# EAGLE design Shutter Pod Schematic (EAGLE 6.5.0)
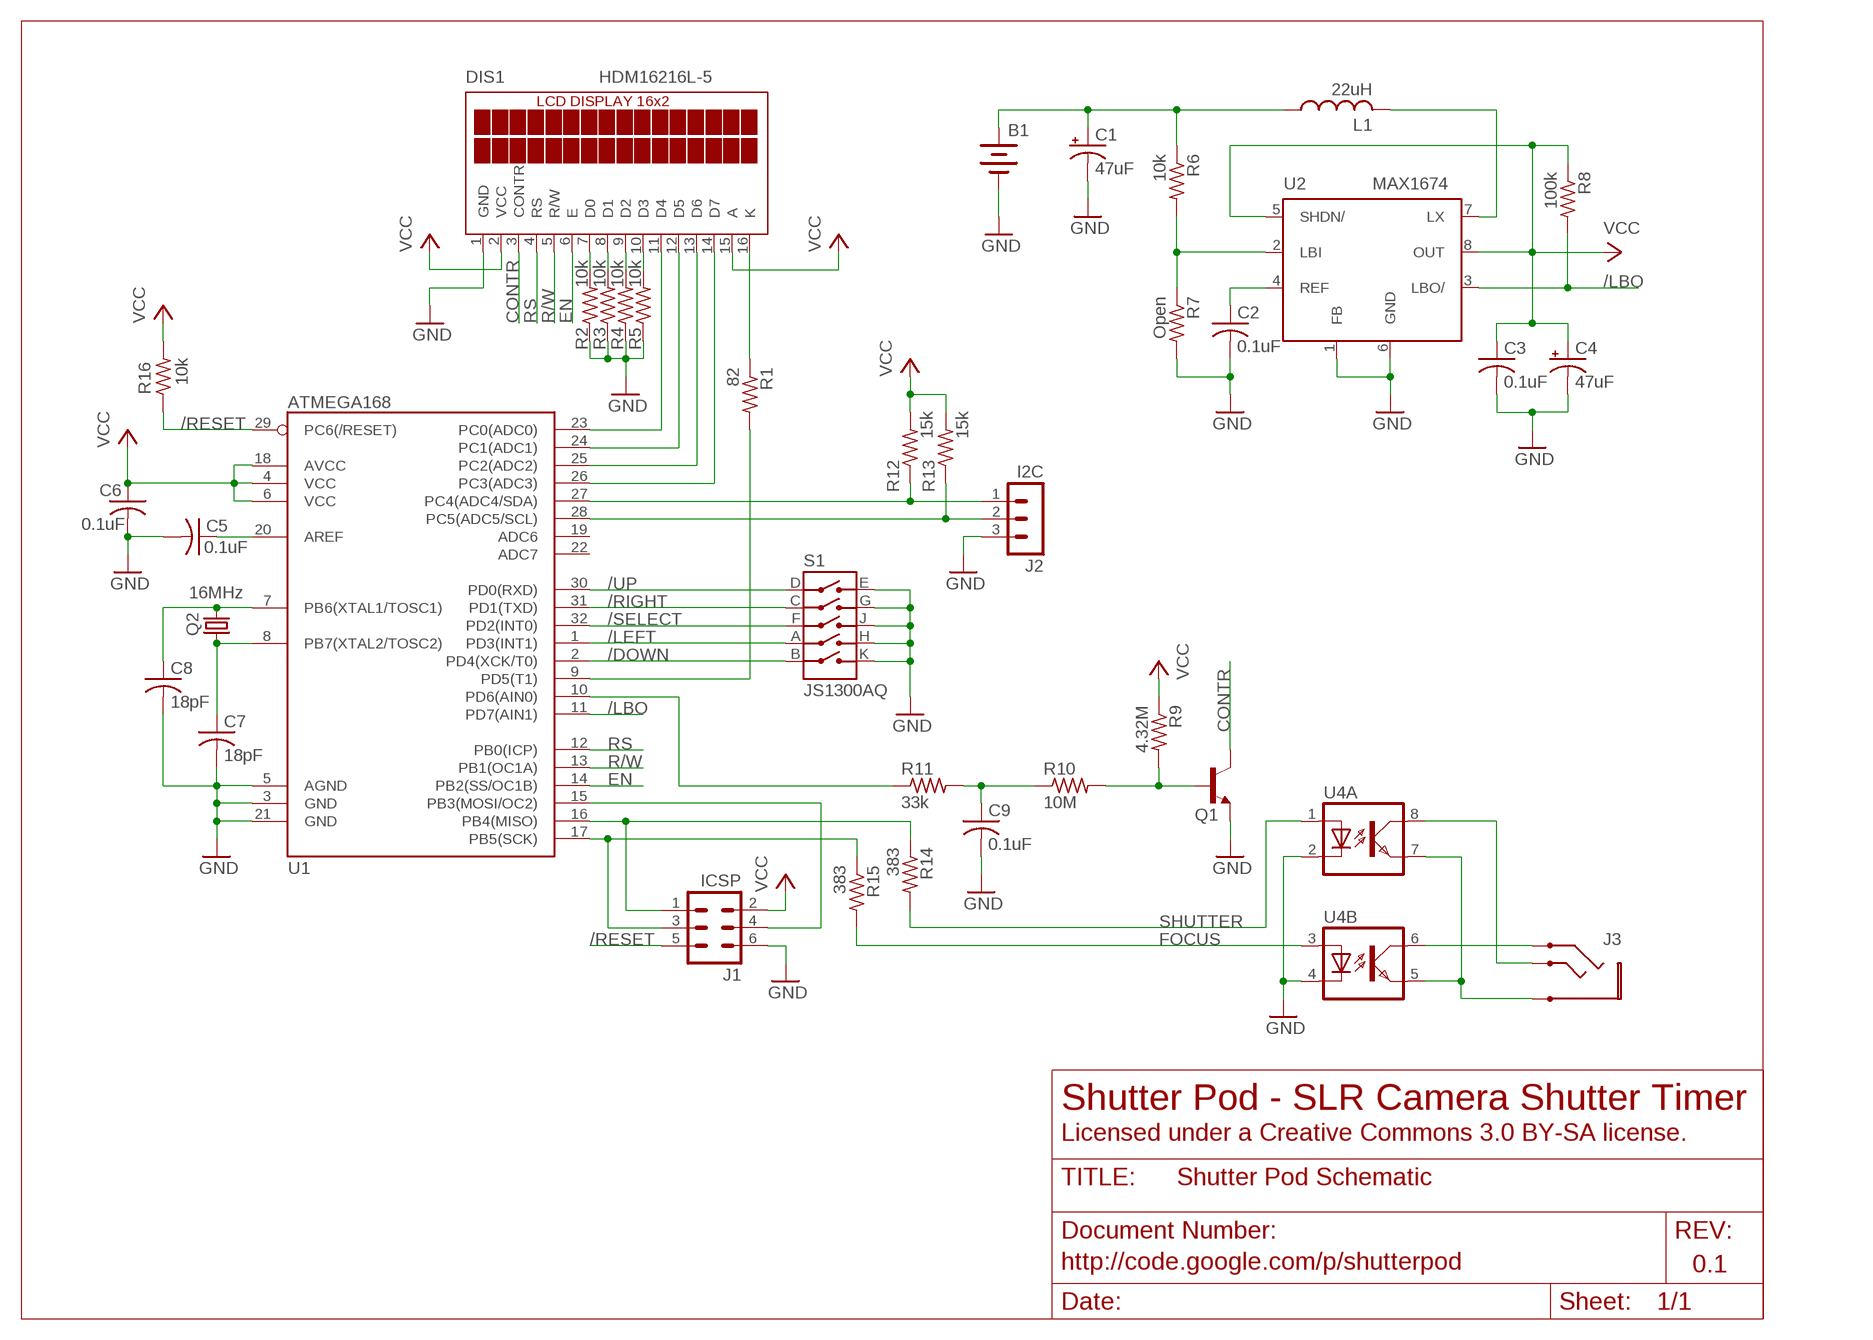
[diagram p0: schematic, sheet 1]

## Parts
B1  BATTERY  [BATTERY]
C1  47uF  CPOL-USSMCD  [SMC_D]
C2  0.1uF  C-USC0805  [C0805]
C3  0.1uF  C-USC0805  [C0805]
C4  47uF  CPOL-USSMCD  [SMC_D]
C5  0.1uF  C-USC0805  [C0805]
C6  0.1uF  C-USC0805  [C0805]
C7  18pF  C-USC0805  [C0805]
C8  18pF  C-USC0805  [C0805]
C9  0.1uF  C-USC0805  [C0805]
DIS1  HDM16216L-5  [HDM16216L-5]
J1  ICSP  MA03-2W  [MA03-2W]
J2  I2C  MA03-1W  [MA03-1W]
J3  2.5MM_AUDIO  [161-2625-E]
L1  22uH  L-USL2220P  [L2220P]
Q1  BC817-25SMD  [SOT23-BEC]
Q2  16MHz  CRYSTALHC49UP  [HC49UP]
R1  82  R-US_R0805  [R0805]
R2  10k  R-US_R0805  [R0805]
R3  10k  R-US_R0805  [R0805]
R4  10k  R-US_R0805  [R0805]
R5  10k  R-US_R0805  [R0805]
R6  10k  R-US_R0805  [R0805]
R7  Open  R-US_R0805  [R0805]
R8  100k  R-US_R0805  [R0805]
R9  4.32M  R-US_R0805  [R0805]
R10  10M  R-US_R0805  [R0805]
R11  33k  R-US_R0805  [R0805]
R12  15k  R-US_R0805  [R0805]
R13  15k  R-US_R0805  [R0805]
R14  383  R-US_R0805  [R0805]
R15  383  R-US_R0805  [R0805]
R16  10k  R-US_R0805  [R0805]
S1  JS1300AQ  [JS1300AQ]
U1  ATMEGA168  [TQFP32-08]
U2  MAX1674  [UMAX8]
U4  MOCD217M  [SO08]

## Nets
/DOWN: S1.B U1.2(PD4(XCK/T0))
/LBO: R8.2 U1.11(PD7(AIN1)) U2.3(LBO/)
/LEFT: S1.A U1.1(PD3(INT1))
/RESET: J1.5 R16.1 U1.29(PC6(/RESET))
/RIGHT: S1.C U1.31(PD1(TXD))
/SELECT: S1.F U1.32(PD2(INT0))
/UP: S1.D U1.30(PD0(RXD))
CONTR: DIS1.3(CONTR) Q1.C
EN: DIS1.6(E) U1.14(PB2(SS/OC1B))
FOCUS: R15.2 U4.3(B:A)
GND: B1.1(NEGATIVE) C1.- C2.2 C3.2 C4.- C5.2 C6.2 C7.2 C8.2 C9.2 DIS1.1(GND) J1.6 J2.3 Q1.E R2.1 R3.1 R4.1 R5.1 R7.2 S1.E S1.G S1.H S1.J S1.K U1.3(GND) U1.5(AGND) U1.21(GND) U2.1(FB) U2.6(GND) U4.2(A:C) U4.4(B:C)
MISO: J1.1 R14.1 U1.16(PB4(MISO))
MOSI: J1.4 U1.15(PB3(MOSI/OC2))
N$1: DIS1.11(D4) U1.23(PC0(ADC0))
N$2: DIS1.12(D5) U1.24(PC1(ADC1))
N$3: DIS1.13(D6) U1.25(PC2(ADC2))
N$4: DIS1.14(D7) U1.26(PC3(ADC3))
N$5: R1.2 U1.9(PD5(T1))
N$6: R11.1 U1.10(PD6(AIN0))
N$7: Q1.B R9.2 R10.2
N$8: DIS1.16(K) R1.1
N$10: B1.2(POSITIVE) C1.+ L1.1 R6.1
N$11: C5.1 U1.20(AREF)
N$12: DIS1.7(D0) R2.2
N$13: DIS1.8(D1) R3.2
N$14: DIS1.9(D2) R4.2
N$15: DIS1.10(D3) R5.2
N$16: C2.1 U2.4(REF)
N$18: R6.2 R7.1 U2.2(LBI)
N$19: C9.1 R10.1 R11.2
N$20: L1.2 U2.7(LX)
N$21: C8.1 Q2.2 U1.7(PB6(XTAL1/TOSC1))
N$22: C7.1 Q2.1 U1.8(PB7(XTAL2/TOSC2))
N$23: J3.SA(SLEEVE) U4.5(B:EMIT) U4.7(A:EMIT)
N$24: U4.6(B:COL)
N$28: J3.T(TIP) U4.8(A:COL)
R/W: DIS1.5(R/W) U1.13(PB1(OC1A))
RS: DIS1.4(RS) U1.12(PB0(ICP))
SCK: J1.3 R15.1 U1.17(PB5(SCK))
SCL: J2.2 R13.1 U1.28(PC5(ADC5/SCL))
SDA: J2.1 R12.1 U1.27(PC4(ADC4/SDA))
SHUTTER: R14.2 U4.1(A:A)
VCC: C3.1 C4.+ C6.1 DIS1.2(VCC) DIS1.15(A) J1.2 R8.1 R9.1 R12.2 R13.2 R16.2 U1.4(VCC) U1.6(VCC) U1.18(AVCC) U2.5(SHDN/) U2.8(OUT)
Unconnected: J3.R(RING) U1.19(ADC6) U1.22(ADC7)

## Notes on the sheet
- Shutter Pod - SLR Camera Shutter Timer
- Licensed under a Creative Commons 3.0 BY-SA license.
- http://code.google.com/p/shutterpod | 0.1

## Library data of the parts
B1 = shutter-pod:BATTERY
C1 C4 = rcl:CPOL-US: POLARIZED CAPACITOR, American symbol
C2 C3 C5-C9 = rcl:C-US: CAPACITOR, American symbol
DIS1 = shutter-pod:HDM16216L-5: Tuxgraphics LCD display 16x2 characters reflective, without background light Source: tuxgr_12x2_r2.pdf
J1 = con-lstb:MA03-2W
J2 = con-lstb:MA03-1W
J3 = shutter-pod:2.5MM_AUDIO
L1 = rcl:L-US: INDUCTOR, American symbol
Q1 = transistor-npn:BC817*: NPN Transistor
Q2 = crystal:CRYSTAL: CRYSTAL
R1-R16 = rcl:R-US_: RESISTOR, American symbol
S1 = switch-misc:JS1300AQ
U1 = SparkFun:ATMEGA168
U2 = maxim:MAX1674: DC/DC CONVERTER
U4 = shutter-pod:MOCD217M

## Board
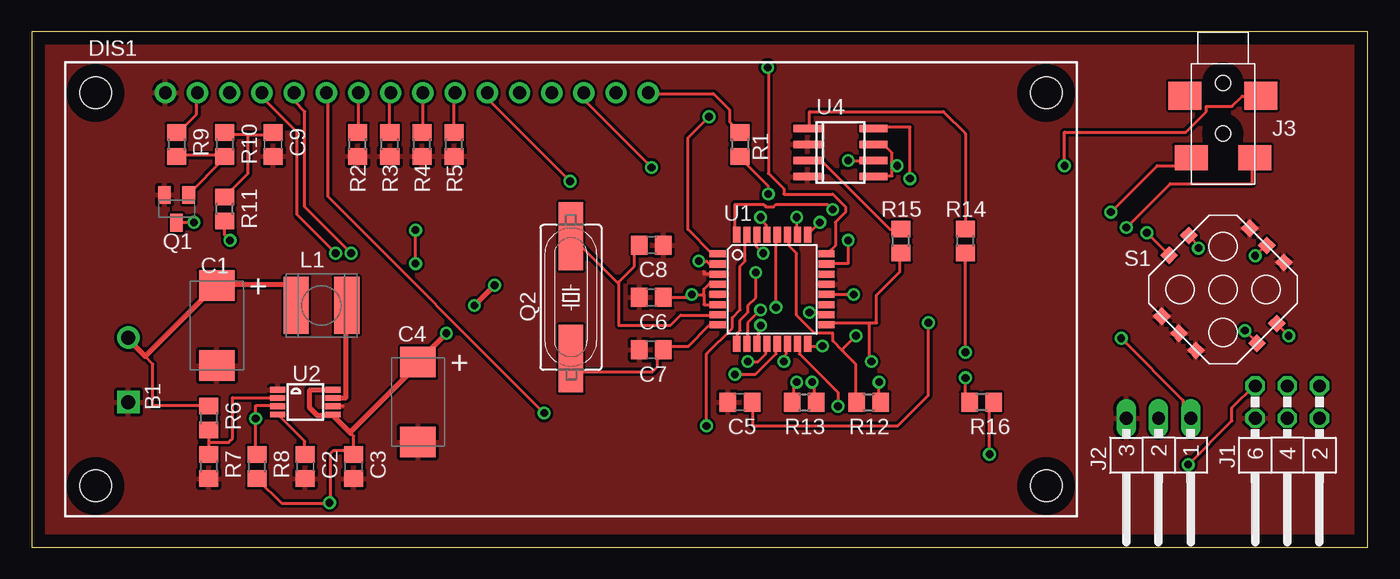
[diagram p1: board, top side]
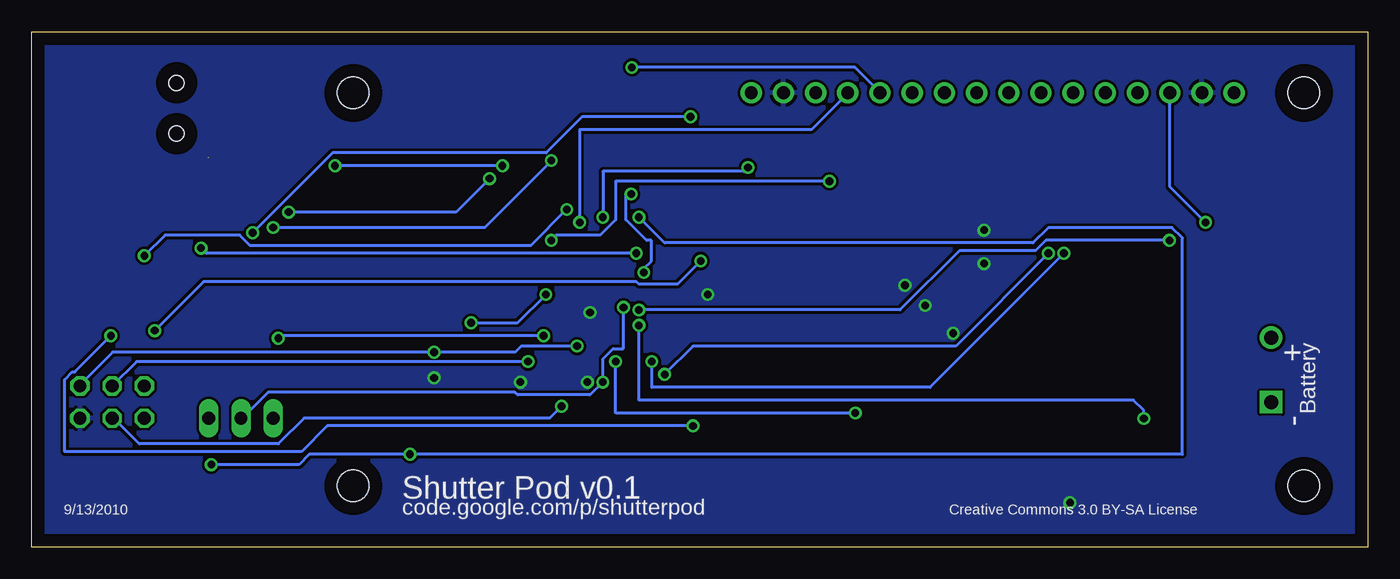
[diagram p2: board, bottom side, seen from below]

Size 105.41 x 40.64 mm. Coordinates in mm from the lower left corner, seen from the top.
Outline: 0,0 105.41,0 105.41,40.64 0,40.64 0,0
Copper layers (1*16): Top 0.035mm / dielectric 1.5mm / Bottom 0.035mm
Design rules "default": minimum track width 10mil, minimum drill 24mil, track to track 8mil, track to pad 8mil, pad to pad 8mil, via to via 8mil, smd to smd 8mil, copper to edge 40mil, drill to drill 8mil, minimum pad ring 10mil, minimum via ring 8mil, stop-mask expansion 4mil, vias tented up to drill 0mil, thermal gap 10mil

### Footprints (pad centres in the part's own frame; a part is rotated, then mirrored left to right if it is on the bottom)
BATTERY = drill 1.1 pad 1.778 square: 1 -2.54,0 | drill 1.1 pad 1.778: 2 2.54,0
SMC_D = smd 2.4 x 2.8: + -3.15,0; - 3.15,0
C0805 = smd 1.3 x 1.5: 1 -0.95,0; 2 0.95,0
HDM16216L-5 = drill 1 pad 1.676: 1 -32,15.5; 2 -29.46,15.5; 3 -26.92,15.5; 4 -24.38,15.5; 5 -21.84,15.5; 6 -19.3,15.5; 7 -16.76,15.5; 8 -14.22,15.5; 9 -11.68,15.5; 10 -9.14,15.5; 11 -6.6,15.5; 12 -4.06,15.5; 13 -1.52,15.5; 14 1.02,15.5; 15 3.56,15.5; 16 6.1,15.5 | hole 2.5: -37.5,-15.5; 37.5,-15.5; -37.5,15.5; 37.5,15.5
MA03-2W = drill 1.016 octagon: 1 -2.54,-5.08; 2 -2.54,-2.54; 3 0,-5.08; 4 0,-2.54; 5 2.54,-5.08; 6 2.54,-2.54
MA03-1W = drill 1.016 long: 1 -2.54,-2.54; 2 0,-2.54; 3 2.54,-2.54
161-2625-E = smd 2 x 2.6: R 7.4,2.5; T 7.4,-2.5 | smd 2.2 x 2.6: SA 2.5,3; SB 2.5,-3 | hole 1.2: 1.5,0; 5.5,0
L2220P = smd 2 x 4.5: 1 -2,0; 2 2,0
SOT23-BEC = smd 1 x 1.4: B -0.95,-1.1; C 0,1.1; E 0.95,-1.1
HC49UP = smd 5.334 x 1.93: 1 -4.826,0; 2 4.826,0
R0805 = smd 1.3 x 1.5: 1 -0.95,0; 2 0.95,0
JS1300AQ = smd 0.991 x 0.991: A -4.902,-1.105; B 4.902,-1.105; C 4.902,1.105; D -4.902,1.105; E -1.905,4.902; F 0,4.902; G 1.905,4.902; H -1.905,-4.902; J 0,-4.902; K 1.905,-4.902
TQFP32-08 = smd 1.27 x 0.559: 1 -4.293,2.8; 2 -4.293,2; 3 -4.293,1.2; 4 -4.293,0.4; 5 -4.293,-0.4; 6 -4.293,-1.2; 7 -4.293,-2; 8 -4.293,-2.8; 17 4.293,-2.8; 18 4.293,-2; 19 4.293,-1.2; 20 4.293,-0.4; 21 4.293,0.4; 22 4.293,1.2; 23 4.293,2; 24 4.293,2.8 | smd 0.559 x 1.27: 9 -2.8,-4.293; 10 -2,-4.293; 11 -1.2,-4.293; 12 -0.4,-4.293; 13 0.4,-4.293; 14 1.2,-4.293; 15 2,-4.293; 16 2.8,-4.293; 25 2.8,4.293; 26 2,4.293; 27 1.2,4.293; 28 0.4,4.293; 29 -0.4,4.293; 30 -1.2,4.293; 31 -2,4.293; 32 -2.8,4.293
UMAX8 = smd 0.45 x 1.2: 1 -0.975,-2.175; 2 -0.325,-2.175; 3 0.325,-2.175; 4 0.975,-2.175; 5 0.975,2.175; 6 0.325,2.175; 7 -0.325,2.175; 8 -0.975,2.175
SO08 = smd 0.6 x 2.2: 1 -1.905,-2.6; 2 -0.635,-2.6; 3 0.635,-2.6; 4 1.905,-2.6; 5 1.905,2.6; 6 0.635,2.6; 7 -0.635,2.6; 8 -1.905,2.6

### Placement (x,y rotation side)
B1  7.62,13.97 90 top
C1  14.61,17.46 270 top
C2  21.59,6.35 270 top
C3  25.4,6.35 270 top
C4  30.48,11.43 270 top
C5  55.88,11.43 180 top
C6  48.9,19.68 180 top
C7  48.9,15.56 180 top
C8  48.9,23.81 0 top
C9  19.05,31.75 270 top
DIS1  42.55,20.32 0 top
J1  99.06,7.62 180 top
J2  88.9,7.62 180 top
J3  93.98,38.1 270 top
L1  22.86,19.05 0 top
Q1  11.43,26.67 180 top
Q2  42.55,19.68 90 top
R1  55.88,31.75 270 top
R2  25.72,31.75 90 top
R3  28.26,31.75 90 top
R4  30.8,31.75 90 top
R5  33.34,31.75 90 top
R6  13.97,10.16 270 top
R7  13.97,6.35 270 top
R8  17.78,6.35 90 top
R9  11.43,31.75 270 top
R10  15.24,31.75 270 top
R11  15.24,26.67 90 top
R12  66.04,11.43 0 top
R13  60.96,11.43 0 top
R14  73.66,24.13 90 top
R15  68.58,24.13 90 top
R16  74.93,11.43 180 top
S1  93.98,20.32 315 top
U1  58.42,20.32 0 top
U2  21.59,11.43 270 top
U4  63.82,31.11 270 top

### Tracks (layer width: path | path; a pad name or v marks a point on that pad's centre or on a via)
/DOWN  (via drill 0.61)
  Top 0.254: v95.71,17.07 96.52,16.26 S1.B | v52.63,22.55 53.24,22.55 53.44,22.35 54.05,22.35 U1.2
  Bottom 0.254: v95.71,17.07 91.85,20.93 57.71,20.93 57.51,20.73 54.46,20.73 v52.63,22.55
/LBO  (via drill 0.61)
  Top 0.254: U2.3 19.3,11.18 17.68,11.18 v17.68,10.13 17.68,7.32 R8.2 | v57.51,17.48 57.51,17.07 57.3,16.87 57.3,16.05 U1.11
  Bottom 0.254: v57.51,17.48 57.51,11.58 18.49,11.58 17.68,10.77 v17.68,10.13
/LEFT  (via drill 0.61)
  Top 0.254: v87.99,24.79 89.61,23.16 S1.A | v53.44,33.93 51.77,32.26 51.77,25.04 53.65,23.16 54.05,23.16 U1.1
  Bottom 0.254: v87.99,24.79 81.69,31.09 64.82,31.09 61.98,33.93 v53.44,33.93
/RESET  (via drill 0.61)
  Top 0.254: v57.51,26.01 57.51,25.81 57.91,25.4 57.91,24.79 U1.29 | v91.24,6.5 94.69,9.96 94.69,10.97 96.52,12.8 J1.5 | v75.56,7.32 75.56,11.38 R16.1
  Bottom 0.254: v57.51,26.01 55.47,23.98 26.42,23.98 25.2,25.2 15.44,25.2 14.63,24.38 14.63,7.32 v75.56,7.32 83.52,7.32 84.33,6.5 v91.24,6.5
/RIGHT  (via drill 0.61)
  Top 0.254: v99.16,16.66 98.35,17.48 S1.C | v53.24,9.55 53.24,15.24 55.27,17.27 55.27,18.09 55.88,18.69 55.88,22.15 56.29,22.55 56.29,24.59 U1.31
  Bottom 0.254: v99.16,16.66 102.01,13.82 102.21,13.82 102.82,13.21 102.82,7.52 84.12,7.52 82.09,9.55 v53.24,9.55
/SELECT  (via drill 0.61)
  Top 0.254: v96.52,22.96 97.33,23.77 S1.F | v63.2,26.62 62.79,27.03 58.73,27.03 58.52,26.82 57.91,26.82 57.71,27.03 55.47,27.03 55.47,24.79 U1.32
  Bottom 0.254: v96.52,22.96 94.89,24.59 89,24.59 88.19,23.77 66.04,23.77 v63.2,26.62
/UP  (via drill 0.61)
  Top 0.254: v92.05,23.57 92.05,23.77 91.44,24.38 S1.D | v57.71,23.16 57.1,23.77 57.1,24.59 U1.30
  Bottom 0.254: v92.05,23.57 91.64,23.16 v57.71,23.16
CONTR  (via drill 0.61)
  Top 0.254: v12.8,25.6 11.58,25.6 Q1.C
  Bottom 0.254: v12.8,25.6 15.62,28.43 DIS1.3
EN  (via drill 0.61)
  Top 0.254: v59.33,14.63 59.33,15.04 59.54,15.24 59.54,15.85 U1.14 | v40.44,10.57 23.37,27.64 23.37,35.76 DIS1.6
  Bottom 0.254: v59.33,14.63 59.33,10.57 v40.44,10.57
FOCUS
  Top 0.254: 68.68,25.2 R15.2 67.71,25.08 62.31,30.48 U4.3
GND
  Top 0.254: U1.3 54.05,21.54 53.03,21.54 53.03,21.73 | 24.59,11.1 24.38,11.18 23.77,11.18 U2.6
  pour Top: 0,40.64 0,0 105.41,0 105.41,40.64
MISO  (via drill 0.61)
  Top 0.254: v62.38,15.85 61.37,15.85 U1.16 | v73.66,15.37 R14.1
  Bottom 0.254: J1.1 101.6,12.8 99.03,15.37 v73.66,15.37 67.26,15.37 66.79,15.85 v62.38,15.85
MOSI  (via drill 0.61)
  Top 0.254: v63.6,11.1 63.6,12.19 60.55,15.24 60.55,15.85 U1.15
  Bottom 0.254: v63.6,11.1 64.54,10.16 83.92,10.16 85.95,8.13 96.93,8.13 98.96,10.16 J1.4
N$1  (via drill 0.61)
  Top 0.254: v64.41,24.18 64.41,22.35 62.79,22.35 U1.23 | v42.47,28.85 35.97,35.36 35.97,35.76 DIS1.11
  Bottom 0.254: v64.41,24.18 64.01,24.59 60.55,24.59 59.33,25.81 59.33,28.85 v42.47,28.85
N$2  (via drill 0.61)
  Top 0.254: U1.24 62.79,23.16 63.4,23.77 63.4,25.6 64.21,26.42 64.21,26.82 63.2,27.84 59.33,27.84 59.33,28.25 58.12,29.46 58.12,37.8 v58.06,37.82
  Bottom 0.254: v58.06,37.82 40.46,37.82 38.61,35.97 DIS1.12
N$3  (via drill 0.61)
  Top 0.254: v62.18,25.6 61.37,24.79 U1.25
  Bottom 0.254: v62.18,25.6 62.18,32.92 43.89,32.92 41.05,35.76 DIS1.13
N$4  (via drill 0.61)
  Top 0.254: v60.35,26.01 60.35,24.79 U1.26 | v48.91,29.93 43.69,35.15 43.69,35.76 DIS1.14
  Bottom 0.254: v60.35,26.01 60.35,29.62 49.23,29.62 v48.91,29.93
N$5  (via drill 0.61)
  Top 0.254: v57.12,21.65 57.12,19.66 56.52,19.05 56.52,18.52 55.88,17.88 55.88,17.07 55.68,16.87 55.68,16.05 U1.9 | v58.12,27.84 58.12,28.45 55.88,30.68 R1.2
  Bottom 0.254: 58.52,27.64 58.52,25.81 56.9,24.18 56.52,24.18 56.52,22.54 57.12,21.93 v57.12,21.65 | 58.52,27.64 58.52,27.84 | v58.12,27.84 58.32,27.64 58.52,27.64
N$6  (via drill 0.61)
  Top 0.254: v57.51,18.69 56.49,17.68 56.49,16.05 U1.10 | v15.65,24.18 15.24,24.59 R11.1
  Bottom 0.254: v57.51,18.69 36.89,18.69 32.22,23.37 26.21,23.37 25.4,24.18 v15.65,24.18
N$7
  Top 0.254: Q1.B 12.39,27.84 15.24,30.68 R10.2 15.24,30.89 11.58,30.89 R9.2
N$8
  Top 0.254: R1.1 55.88,32.72 55.07,33.53 55.07,34.47 53.77,35.76 48.77,35.76 DIS1.16
N$10
  Top 0.254: 20.73,20.73 20.73,19.1 L1.1 | 14.63,20.73 C1.+ 14.43,20.52 | 8.94,15.04 9.55,14.43 9.55,11.18 13.82,11.18 R6.1
  Top 0.406: 14.63,20.73 20.73,20.73 | B1.2 7.72,16.46 7.72,16.26 8.94,15.04 14.43,20.52
N$11  (via drill 0.61)
  Top 0.254: v64.85,19.91 62.79,19.91 U1.20 | v70.74,17.68 70.74,11.96 68.33,9.55 56.9,9.55 56.9,11.38 C5.1
  Bottom 0.254: v64.85,19.91 67.08,17.68 v70.74,17.68
N$12
  Top 0.254: R2.2 25.81,32.72 25.81,35.76 DIS1.7
N$13
  Top 0.254: R3.2 28.25,32.72 28.25,35.76 DIS1.8
N$14
  Top 0.254: R4.2 30.89,32.72 30.89,35.76 DIS1.9
N$15
  Top 0.254: R5.2 33.33,32.72 33.33,35.76 DIS1.10
N$16
  Top 0.254: U2.4 19.51,10.36 21.54,8.33 21.54,7.32 C2.1
N$18
  Top 0.254: 14.02,8.26 15.56,8.26 15.85,8.55 15.85,11.79 19.3,11.79 U2.2 | R7.1 14.02,7.32 14.02,8.26 | 14.02,8.26 14.02,9.14 R6.2
N$19
  Top 0.254: 17.07,32.51 17.07,29.46 15.24,27.64 R11.2 | 17.07,32.51 15.24,32.51 R10.1 | 17.07,32.51 18.9,32.51 C9.1
N$20
  Top 0.254: U2.7 23.77,11.79 | 24.79,18.9 L1.2
  Top 0.406: 23.77,11.79 24.79,11.79 24.79,18.9
N$21
  Top 0.254: 42.67,25.6 42.67,24.59 Q2.2 46.33,20.73 | 46.33,20.73 46.33,20.93 47.55,22.15 47.55,23.57 47.75,23.77 C8.1 | 46.33,20.73 46.33,17.48 50.39,17.48 51.21,18.29 54.05,18.29 U1.7
N$22
  Top 0.254: U1.8 54.05,17.48 53.44,17.48 51.82,15.85 49.99,15.85 49.99,15.65 C7.1 49.78,15.44 49.38,15.04 49.38,14.22 48.97,13.82 42.67,13.82 42.67,14.83 Q2.1
N$23  (via drill 0.61)
  Top 0.254: 67.87,30.48 67.87,31.09 67.26,31.7 66.45,31.7 U4.7 | 67.87,30.48 67.87,29.26 66.45,29.26 U4.5 | v81.48,30.07 81.48,32.72 91.03,32.72 92.66,34.34 92.66,34.75 94.69,34.75 95.5,35.56 96.93,35.56 J3.SA | 67.87,30.48 v68.28,30.07
  Bottom 0.254: v68.28,30.07 v81.48,30.07
N$24  (via drill 0.61)
  Top 0.254: v86.36,25.2 89.81,28.65 96.32,28.65 96.32,30.68 | v64.41,30.48 U4.6
  Bottom 0.254: v64.41,30.48 69.7,25.2 v86.36,25.2
N$28  (via drill 0.61)  (1 unrouted)
  Top 0.254: v69.29,29.06 69.29,33.12 66.45,33.12 U4.8 | v85.14,26.42 88.8,30.07 91.44,30.07 91.44,30.68
  Bottom 0.254: v69.29,29.06 71.93,26.42 v85.14,26.42
R/W  (via drill 0.61)
  Top 0.254: v55.47,13.61 57.1,13.61 58.73,15.24 58.73,15.85 U1.13 | v25.2,23.16 21.54,26.82 21.54,34.34 20.73,35.15 20.73,35.76 DIS1.5
  Bottom 0.254: v55.47,13.61 53.24,15.85 32.51,15.85 v25.2,23.16
RS  (via drill 0.61)
  Top 0.254: v56.49,14.63 57.3,14.63 57.91,15.24 57.91,15.85 U1.12 | v23.98,23.16 20.93,26.21 20.93,32.72 18.29,35.36 18.29,35.76 DIS1.4
  Bottom 0.254: v56.49,14.63 56.49,12.6 34.54,12.6 v23.98,23.16
SCK  (via drill 0.61)
  Top 0.254: 66.04,17.68 66.65,17.68 66.65,19.86 68.48,21.69 68.48,23.16 R15.1 | 66.04,17.68 62.79,17.68 U1.17 | v66.24,14.63 66.04,14.83 66.04,17.68
  Bottom 0.254: v66.24,14.63 97.13,14.63 J1.3
SCL  (via drill 0.61)
  Top 0.254: v58.73,18.9 58.73,24.59 U1.28 | v60.35,13.01 60.15,12.8 60.15,11.58 R13.1
  Bottom 0.254: v58.73,18.9 58.73,15.65 59.54,15.65 60.35,14.83 v60.35,13.01 61.37,11.99 67.06,11.99 67.26,12.19 86.77,12.19 88.8,10.16 J2.2
SDA  (via drill 0.61)
  Top 0.254: 64.01,15.44 65.02,14.43 65.02,11.58 R12.1 | 64.01,15.44 63.2,16.26 63.2,16.87 61.77,16.87 60.35,18.29 60.35,23.16 59.74,23.77 59.74,24.59 U1.27 | J2.1 90.83,10.77 90.83,11.58 v85.95,16.46 | v65.02,16.66 64.01,15.65 64.01,15.44
  Bottom 0.254: v85.95,16.46 85.75,16.66 v65.02,16.66
SHUTTER
  Top 0.254: U4.1 61.37,33.12 61.37,34.34 71.93,34.34 73.66,32.61 R14.2
VCC  (via drill 0.61)
  Top 0.254: 23.57,12.39 U2.8 | 30.48,14.63 C4.+ 30.48,14.43 | 23.57,10.36 U2.5 23.77,10.36 | 25.2,9.14 25.2,8.94 25.4,8.74 25.4,7.62 | 25.4,7.62 C3.1 | 25.4,7.62 23.81,7.62 23.57,7.38 23.57,3.45 19.71,3.45 17.88,5.28 R8.1 | DIS1.2 13.01,35.76 13.01,34.14 11.58,32.72 R9.1 | v30.28,22.35 v30.28,24.99 | U1.4 54.05,20.73 53.43,20.73 53.03,20.33 53.03,19.91 | U1.6 53.03,19.12 53.03,19.91 | 53.03,19.91 v52.07,19.91 52.02,19.91 52.02,19.71 49.99,19.71 C6.1 | v61.57,13.01 61.77,12.8 61.77,11.58 R13.2 | v66.85,13.01 66.85,11.58 R12.2 | v61.37,18.49 62.59,18.49 U1.18 | v73.66,13.34 73.66,11.58 R16.2
  Top 0.406: 23.57,12.39 21.95,12.39 21.95,10.97 22.55,10.36 23.57,10.36 | 30.48,14.63 v32.72,16.87 | 25.2,9.14 30.48,14.43 | 25.2,8.94 23.77,10.36 | v34.92,19.05 v36.51,20.64
  other vias: 23.5,3.49
  pour Bottom: 0,0 105.41,0 105.41,40.64 0,40.64

### Text on the board
tPlace: + | +
bPlace: + | Battery | - | 9/13/2010
bNames: Shutter Pod v0.1 | Creative Commons 3.0 BY-SA License | code.google.com/p/shutterpod
tDocu: GND | SCL | SDA | I2C | ICSP